# Altium schematic sheet ESP8266_144.SchDoc
size A4
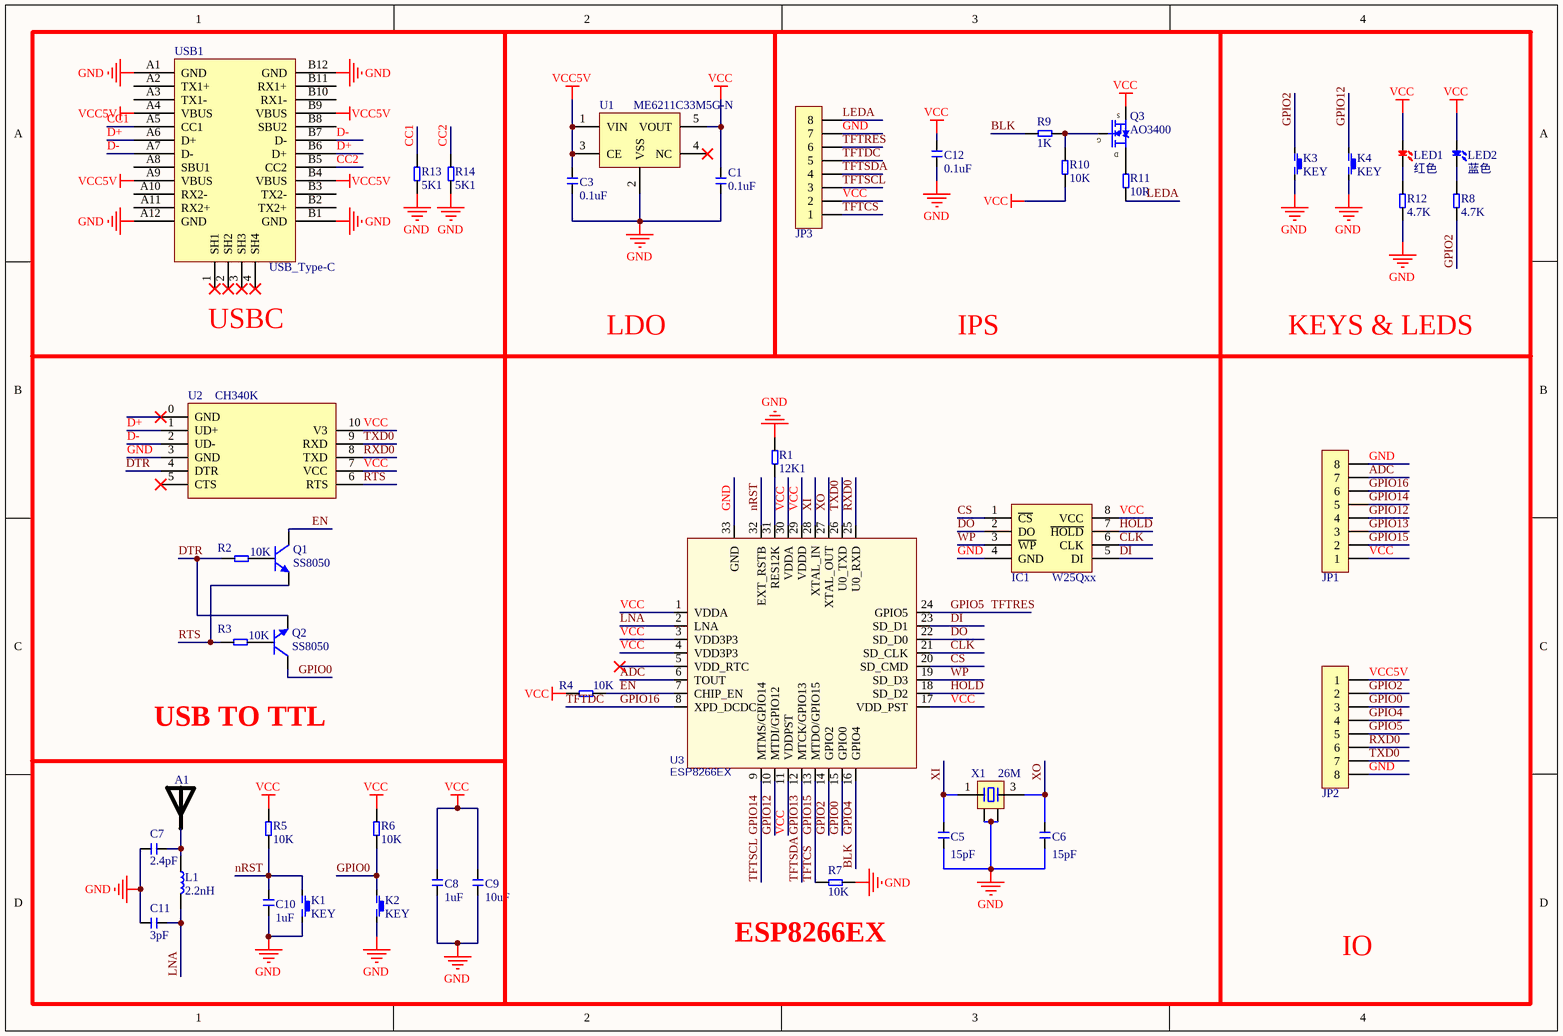
[diagram p0: ESP8266_144.SchDoc]

## Parts
A1  RAINSUN  [PCBComponent_1]  (value not drawn)
C1  0.1uF  [C 0603_M]
C3  0.1uF  [C 0603_M]
C5  15pF  [C 0603_M]
C6  15pF  [C 0603_M]
C7  2.4pF  [C 0603_M]
C8  1uF  [C 0603_M]
C9  10uF  [C 0603_M]
C10  1uF  [C 0603_M]
C11  3pF  [C 0603_M]
C12  0.1uF  [C 0603_M]
IC1  W25Qxx  [SOP8W_L]
JP1  HDR-1X8  [HDR2.54-LI-8P]  (value not drawn)
JP2  HDR-1X8  [HDR2.54-LI-8P]  (value not drawn)
JP3  HDR-1X8  [1.14 IPS]  (value not drawn)
K1  KEY  [KEY 4.2*3.2*2.5]
K2  KEY  [KEY 4.2*3.2*2.5]
K3  KEY  [KEY 4.2*3.2*2.5]
K4  KEY  [KEY 4.2*3.2*2.5]
L1  2.2nH  [L 0603_M]
LED1  红色  [LED 0603R_M]
LED2  蓝色  [LED 0603B_M]
Q1  SS8050  [SOT23-3M]
Q2  SS8050  [SOT23-3M]
Q3  AO3400  [SOT23-3M]
R1  12K1  [R 0603_M]
R2  10K  [R 0603_M]
R3  10K  [R 0603_M]
R4  10K  [R 0603_M]
R5  10K  [R 0603_M]
R6  10K  [R 0603_M]
R7  10K  [R 0603_M]
R8  4.7K  [R 0603_M]
R9  1K  [R 0603_M]
R10  10K  [R 0603_M]
R11  10R  [R 0603_M]
R12  4.7K  [R 0603_M]
R13  5K1  [R 0603_M]
R14  5K1  [R 0603_M]
U1  ME6211C33M5G-N  [SOT23-5N]
U2  CH340K  [CH340K]
U3  ESP8266EX  [QFN32 5x5_M]
USB1  USB_Type-C  [TYPEC沉板]
X1  26M  [OSC 3225-4P]

## Nets
GND: C1.1 C3.1 C5.1 C6.1 C7.2 C8.1 C9.1 C10.1 C11.2 C12.1 IC1.4(GND) JP1.8 JP2.8 JP3.7 K1.3 K2.3 K3.3 K4.3 R1.1 R7.1 R12.2 R13.2 R14.2 U1.2(VSS) U2.3(GND) U3.33(GND) USB1.A1(GND) USB1.A12(GND) USB1.B1(GND) USB1.B12(GND) X1.2 X1.4
VCC: C1.2 C8.2 C9.2 C12.2 IC1.8(VCC) JP1.1 JP3.2 LED1.1(A) LED2.1(A) Q3.2(S) R4.1 R5.1 R6.1 R10.1 U1.5(VOUT) U2.7(VCC) U2.10(V3) U3.1(VDDA) U3.3(VDD3P3) U3.4(VDD3P3) U3.11(VDDPST) U3.17(VDD_PST) U3.29(VDDD) U3.30(VDDA)
VCC5V: C3.2 JP2.1 U1.1(VIN) U1.3(CE) USB1.A4(VBUS) USB1.A9(VBUS) USB1.B4(VBUS) USB1.B9(VBUS)
ADC: JP1.7 U3.6(TOUT)
BLK: JP2.4 R9.1 U3.16(GPIO4)  [also labelled GPIO4]
CC1: R13.1 USB1.A5(CC1)
CC2: R14.1 USB1.B5(CC2)
CLK: IC1.6(CLK) U3.21(SD_CLK)
CS: IC1.1(~{CS}) U3.20(SD_CMD)
D+: U2.1(UD+) USB1.A6(D+) USB1.B6(D+)
D-: U2.2(UD-) USB1.A7(D-) USB1.B7(D-)
DI: IC1.5(DI) U3.23(SD_D1)
DO: IC1.2(DO) U3.22(SD_D0)
DTR: Q2.2(E) R2.2 U2.4(DTR)
EN: Q1.3(C) R4.2 U3.7(CHIP_EN)
GPIO0: JP2.3 K2.1 Q2.3(C) R6.2 U3.15(GPIO0)
GPIO2: JP2.2 K3.1 R8.2 U3.14(GPIO2)
GPIO5: JP2.5 JP3.6 U3.24(GPIO5)  [also labelled TFTRES]
GPIO12: JP1.4 K4.1 U3.10(MTDI/GPIO12)
GPIO13: JP1.3 JP3.4 U3.12(MTCK/GPIO13)  [also labelled TFTSDA]
GPIO14: JP1.5 JP3.3 U3.9(MTMS/GPIO14)  [also labelled TFTSCL]
GPIO15: JP1.2 JP3.1 R7.2 U3.13(MTDO/GPIO15)  [also labelled TFTCS]
GPIO16: JP1.6 JP3.5 U3.8(XPD_DCDC)  [also labelled TFTDC]
HOLD: IC1.7(~{HOLD}) U3.18(SD_D2)
LEDA: JP3.8 R11.1
LNA: C11.1 L1.2 U3.2(LNA)
nRST: C10.2 K1.1 R5.2 U3.32(EXT_RSTB)
RTS: Q1.2(E) R3.2 U2.6(RTS)
RXD0: JP2.6 U2.8(TXD) U3.25(U0_RXD)
TXD0: JP2.7 U2.9(RXD) U3.26(U0_TXD)
WP: IC1.3(~{WP}) U3.19(SD_D3)
XI: C5.2 U3.28(XTAL_IN) X1.1
XO: C6.2 U3.27(XTAL_OUT) X1.3
NetA1_1: A1.1 C7.1 L1.1
NetLED1_2: LED1.2(K) R12.1
NetLED2_2: LED2.2(K) R8.1
NetQ1_1: Q1.1(B) R2.1
NetQ2_1: Q2.1(B) R3.1
NetQ3_1: Q3.1(G) R9.2 R10.2
NetQ3_3: Q3.3(D) R11.2
NetR1_2: R1.2 U3.31(RES12K)

Not connected (* = marked no-connect by the designer): U1 4(NC)*; U2 0(GND)* 5(CTS)*; U3 5(VDD_RTC)*; USB1 1(SH1)* 2(SH2)* 3(SH3)* 4(SH4)* A2(TX1+) A3(TX1-) A8(SBU1) A10(RX2-) A11(RX2+) B2(TX2+) B3(TX2-) B8(SBU2) B10(RX1-) B11(RX1+)

## Notes on the sheet
- (near USB1) USBC
- LDO
- IPS
- KEYS & LEDS
- USB TO TTL
- (near R7) ESP8266EX
- IO

## Library data of the parts
A1 = ANT-Rainsun-AP5120
C1 C3 C5-C12 = C: 无极性贴片电容; 版权归属: 源创客; BOM名称: 无极性贴片电容; 学习资源: www.ooocke.com
IC1 = W25Qxx: 外置Flash; 版权归属: 源创客; BOM名称: 外置Flash; 学习资源: www.ooocke.com
JP1-JP3 = W2.54-Header 8: 8P接插件; 版权归属: 源创客; BOM名称: 8P接插件; 学习资源: www.ooocke.com
L1 = L: 小功率贴片电感; 版权归属: 源创客; BOM名称: 小功率贴片电感; 学习资源: www.ooocke.com
LED1 = LED-SMD_R: 贴片LED; 版权归属: 源创客; BOM名称: 贴片LED; 学习资源: www.ooocke.com
LED2 = LED-SMD_B: 贴片LED; 版权归属: 源创客; BOM名称: 贴片LED; 学习资源: www.ooocke.com
Q1 Q2 = 8050-SMD: 高频放大-NPN型; 版权归属: 源创客; 属性: 40V 1.5A 1W 100MHZ; BOM名称: 高频放大-NPN型; 学习资源: www.ooocke.com
Q3 = AO3400: N沟道场效应管; 版权归属: 源创客; BOM名称: N沟道场效应管; 学习资源: www.ooocke.com
R1-R14 = RES
U1 = XC6210B302: 大电流高速LDO; BOM名称: 过流保护IC; 版权归属: 源创客; 学习资源: www.ooocke.com
U3 = ESP8266EX: BOM_Manufacturer: ESPRESSIF; BOM_Supplier: LCSC; BOM_Manufacturer Part: ESP8266EX; BOM_Supplier Part: C77967; BOM_JLCPCB Part Class: Extended Part; spicePre: U; spiceSymbolName: ESP8266EX
X1 = XTAL-4P: 4脚无源晶振; 版权归属: 源创客; BOM名称: 4脚无源晶振; 学习资源: www.ooocke.com